# EAGLE design LM317TC_V2 (EAGLE 7.2.0)
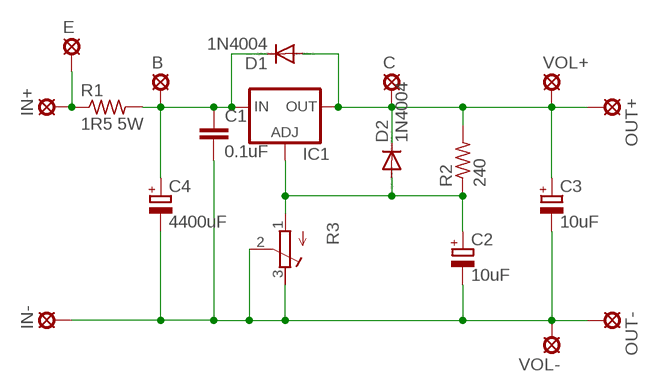
[diagram p0: schematic, sheet 1]

## Parts
B  LSP10  [LSP10]
C  LSP10  [LSP10]
C1  0.1uF  C-EU050-025X075  [C050-025X075]
C2  10uF  CPOL-EUE2.5-7  [E2,5-7]
C3  10uF  CPOL-EUE2.5-7  [E2,5-7]
C4  4400uF  CPOL-EUE2.5-7  [E2,5-7]
D1  1N4004  [DO41-10]
D2  1N4004  [DO41-10]
E  LSP10  [LSP10]
IC1  LM317TS  [317TS]
IN+  LSP10  [LSP10]
IN-  LSP10  [LSP10]
OUT+  LSP10  [LSP10]
OUT-  LSP10  [LSP10]
R1  1R5 5W  R-US_0207/15  [0207/15]
R2  240  R-US_0207/10  [0207/10]
R3  R-TRIMM3339P  [RTRIM3339P]
VOL+  LSP10  [LSP10]
VOL-  LSP10  [LSP10]

## Nets
N$1: B.MP C1.1 C4.+ D1.C IC1.3(IN) R1.2
N$2: C3.+ C.MP D1.A D2.C IC1.2(OUT) OUT+.MP R2.2 VOL+.MP
N$3: C2.+ D2.A IC1.1(ADJ) R2.1 R3.1(A)
N$5: C1.2 C2.- C3.- C4.- IN-.MP OUT-.MP R3.2(S) R3.3(E) VOL-.MP
N$7: E.MP IN+.MP R1.1

## Library data of the parts
B C E IN+ IN- OUT+ OUT- VOL+ VOL- = solpad:LSP10: SOLDER PAD drill 1.0 mm, distributor Buerklin, 12H555
C1 = resistor:C-EU: CAPACITOR, European symbol
C2-C4 = resistor:CPOL-EU: POLARIZED CAPACITOR, European symbol
D1 D2 = diode:1N4004: DIODE general purpose rectifier, 1 A
IC1 = v-reg:LM317TS: VOLTAGE REGULATOR
R1 R2 = resistor:R-US_: RESISTOR, American symbol
R3 = rcl:R-TRIMM: Trimm resistor

## Board
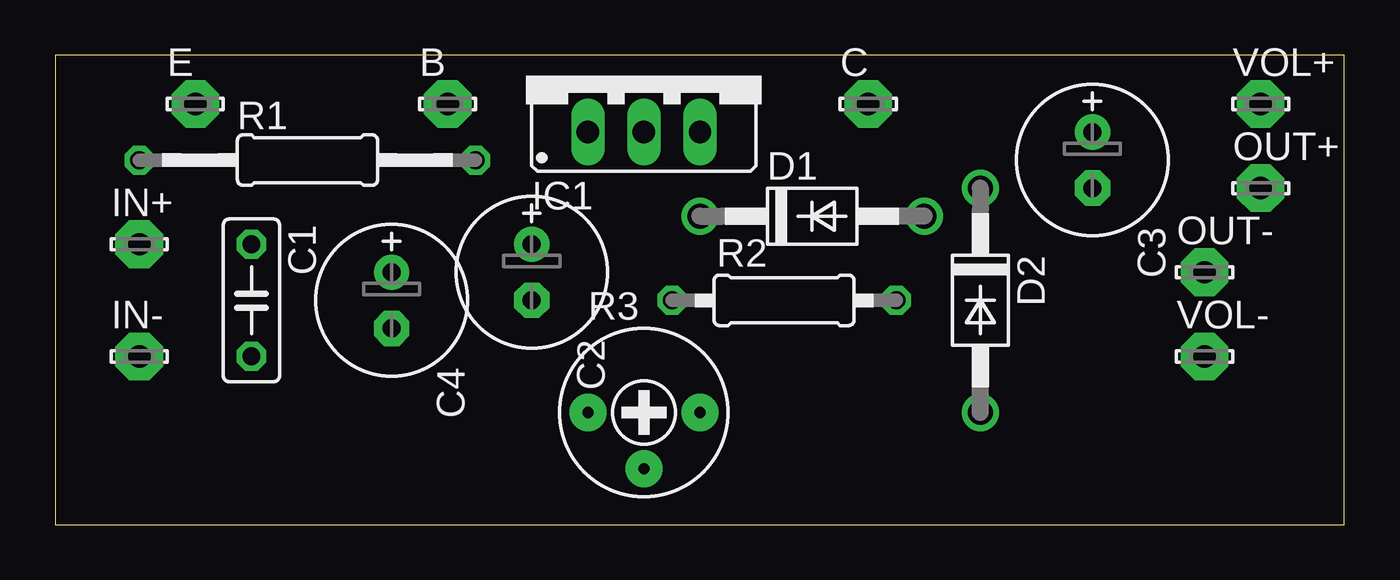
[diagram p1: board, top side]
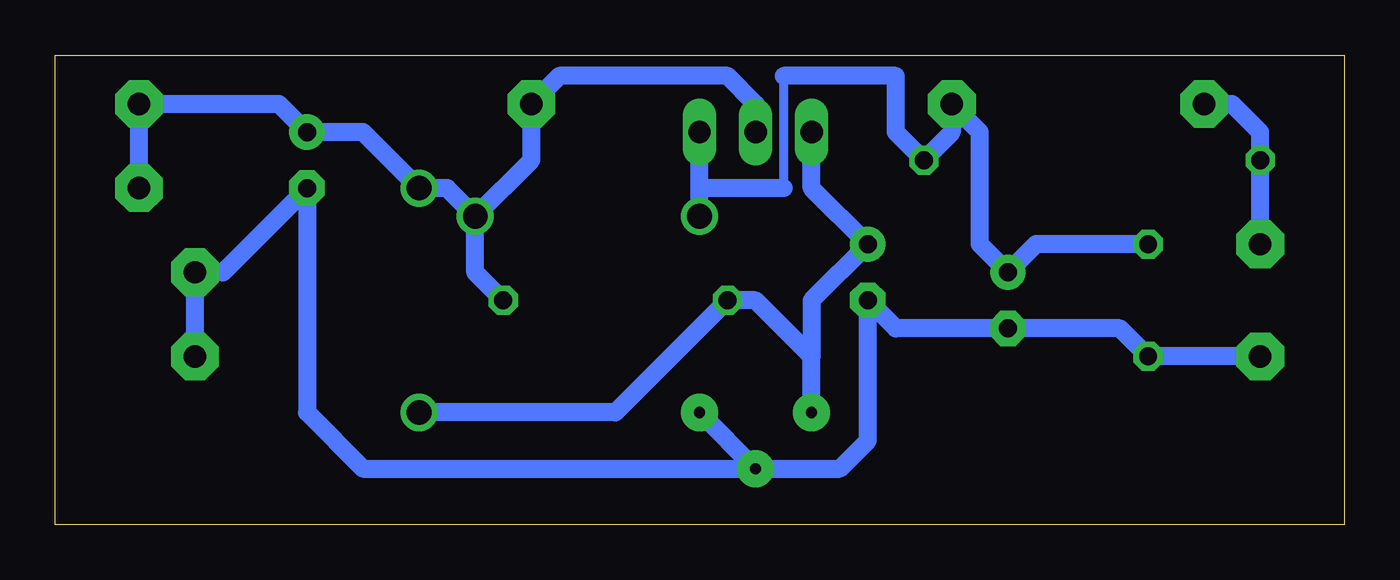
[diagram p2: board, bottom side, seen from below]

Size 58.4 x 21.26 mm. Coordinates in mm from the lower left corner, seen from the top.
Outline: 0,0 58.4,0 58.4,21.26 0,21.26 0,0
Copper layers (1*16): Top 0.035mm / dielectric 1.5mm / Bottom 0.035mm
Design rules "default": minimum track width 10mil, minimum drill 24mil, track to track 8mil, track to pad 8mil, pad to pad 8mil, via to via 8mil, smd to smd 8mil, copper to edge 40mil, drill to drill 8mil, minimum pad ring 10mil, minimum via ring 8mil, stop-mask expansion 4mil, vias tented up to drill 0mil, thermal gap 10mil

### Footprints (pad centres in the part's own frame; a part is rotated, then mirrored left to right if it is on the bottom)
LSP10 = drill 1.016 pad 2.159 octagon: MP 0,0
C050-025X075 = drill 0.813 octagon: 1 -2.54,0; 2 2.54,0
E2,5-7 = drill 0.813 pad 1.6: + -1.27,0 | drill 0.813 pad 1.6 octagon: - 1.27,0
DO41-10 = drill 1.118: A 5.08,0; C -5.08,0
317TS = drill 1.016 long: 1 -2.54,-2.54; 2 0,-2.54; 3 2.54,-2.54
0207/15 = drill 0.813 octagon: 1 -7.62,0; 2 7.62,0
0207/10 = drill 0.813 octagon: 1 -5.08,0; 2 5.08,0
RTRIM3339P = drill 0.5 pad 1.676: 1 -2.54,0; 2 0,-2.54; 3 2.54,0

### Placement (x,y rotation side)
B  17.78,19.05 0 top
C  36.83,19.05 0 top
C1  8.89,10.16 270 top
C2  21.59,11.43 270 top
C3  46.99,16.51 270 top
C4  15.24,10.16 270 top
D1  34.29,13.97 0 top
D2  41.91,10.16 270 top
E  6.35,19.05 0 top
IC1  26.67,20.32 0 top
IN+  3.81,12.7 0 top
IN-  3.81,7.62 0 top
OUT+  54.61,15.24 0 top
OUT-  52.07,11.43 0 top
R1  11.43,16.51 0 top
R2  33.02,10.16 0 top
R3  26.67,5.08 0 top
VOL+  54.61,19.05 0 top
VOL-  52.07,7.62 0 top

### Tracks (layer width: path | path; a pad name or v marks a point on that pad's centre or on a via)
N$1
  Bottom 0.406: 25.4,20.32 25.4,15.24
  Bottom 0.813: D1.C 29.21,15.24 | 29.21,15.24 IC1.3 | C1.1 13.97,12.7 C4.+ 16.51,12.7 16.51,17.78 B.MP 17.78,17.78 R1.2 20.32,17.78 20.32,20.32 25.4,20.32 | 25.4,15.24 29.21,15.24
N$2
  Bottom 0.813: R2.2 39.37,11.43 D1.A | D1.A 36.83,16.51 C.MP 35.56,20.32 27.94,20.32 26.67,19.05 IC1.2 | D1.A 40.64,15.24 D2.C 44.45,17.78 C3.+ 48.26,19.05 VOL+.MP OUT+.MP
N$3
  Bottom 0.813: R3.1 24.13,7.62 | 24.13,7.62 26.67,10.16 R2.1 33.02,5.08 D2.A | 24.13,7.62 24.13,10.16 C2.+ 24.13,15.24 IC1.1
N$5
  Bottom 0.813: IN-.MP C1.2 10.16,8.89 C4.- 20.32,8.89 C2.- 21.59,3.81 22.86,2.54 R3.2 | R3.3 R3.2 | VOL-.MP OUT-.MP 50.8,11.43 C3.- 46.99,5.08 44.45,2.54 R3.2
N$7
  Bottom 0.813: E.MP 5.08,19.05 3.81,17.78 R1.1 IN+.MP